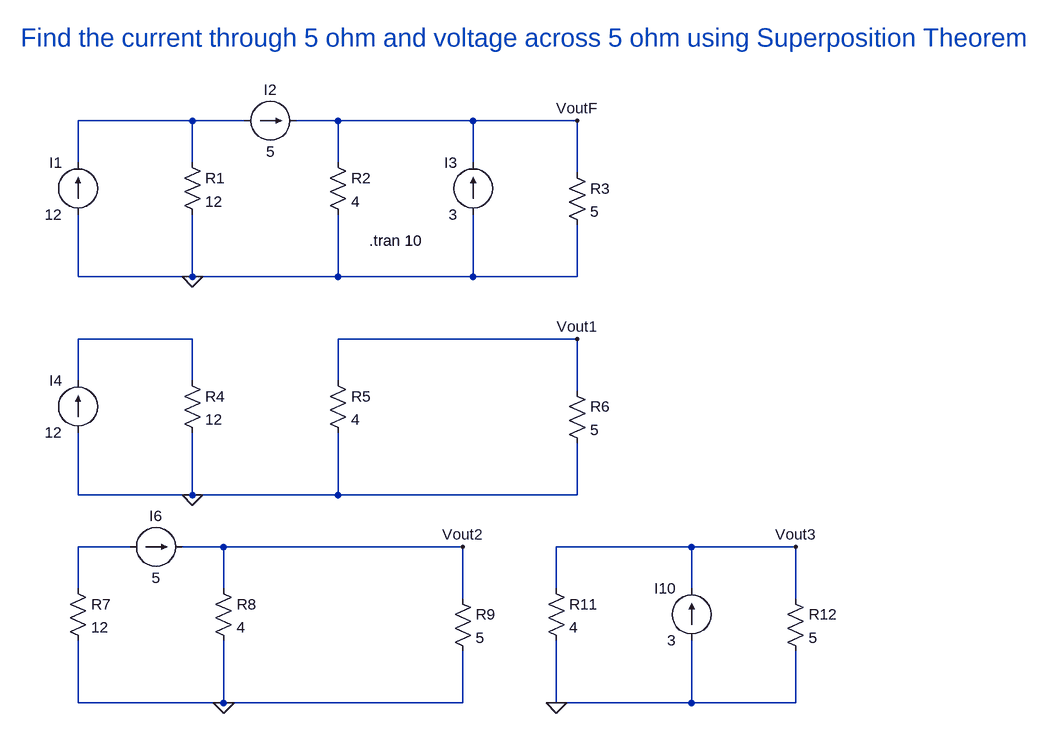
[diagram p0: schematic Lab1_ques2.asc]
Lab1_ques2.asc, the LTspice schematic file:
Version 4
SHEET 1 1444 1152
WIRE -496 160 -672 160
WIRE -416 160 -496 160
WIRE -272 160 -336 160
WIRE -64 160 -272 160
WIRE 96 160 -64 160
WIRE -672 224 -672 160
WIRE -496 224 -496 160
WIRE -272 224 -272 160
WIRE -64 224 -64 160
WIRE 96 240 96 160
WIRE -672 400 -672 304
WIRE -496 400 -496 304
WIRE -496 400 -672 400
WIRE -272 400 -272 304
WIRE -272 400 -496 400
WIRE -64 400 -64 304
WIRE -64 400 -272 400
WIRE 96 400 96 320
WIRE 96 400 -64 400
WIRE -496 496 -672 496
WIRE 96 496 -272 496
WIRE -672 560 -672 496
WIRE -496 560 -496 496
WIRE -272 560 -272 496
WIRE 96 576 96 496
WIRE -672 736 -672 640
WIRE -496 736 -496 640
WIRE -496 736 -672 736
WIRE -272 736 -272 640
WIRE -272 736 -496 736
WIRE 96 736 96 656
WIRE 96 736 -272 736
WIRE -592 816 -672 816
WIRE -448 816 -512 816
WIRE -80 816 -448 816
WIRE 272 816 64 816
WIRE 432 816 272 816
WIRE -672 880 -672 816
WIRE -448 880 -448 816
WIRE 64 880 64 816
WIRE 272 880 272 816
WIRE -80 896 -80 816
WIRE 432 896 432 816
WIRE -672 1056 -672 960
WIRE -448 1056 -448 960
WIRE -448 1056 -672 1056
WIRE -80 1056 -80 976
WIRE -80 1056 -448 1056
WIRE 64 1056 64 960
WIRE 272 1056 272 960
WIRE 272 1056 64 1056
WIRE 432 1056 432 976
WIRE 432 1056 272 1056
FLAG 96 160 VoutF
FLAG 96 496 Vout1
FLAG -80 816 Vout2
FLAG 432 816 Vout3
FLAG -496 736 0
FLAG -496 400 0
FLAG -448 1056 0
FLAG 64 1056 0
SYMBOL res -512 208 R0
SYMATTR InstName R1
SYMATTR Value 12
SYMBOL res -288 208 R0
SYMATTR InstName R2
SYMATTR Value 4
SYMBOL current -672 304 R180
WINDOW 0 24 80 Left 2
WINDOW 3 24 0 Left 2
WINDOW 123 0 0 Left 0
WINDOW 39 0 0 Left 0
SYMATTR InstName I1
SYMATTR Value 12
SYMBOL current -416 160 R270
WINDOW 0 32 40 VTop 2
WINDOW 3 -32 40 VBottom 2
WINDOW 123 0 0 Left 0
WINDOW 39 0 0 Left 0
SYMATTR InstName I2
SYMATTR Value 5
SYMBOL current -64 304 R180
WINDOW 0 24 80 Left 2
WINDOW 3 24 0 Left 2
WINDOW 123 0 0 Left 0
WINDOW 39 0 0 Left 0
SYMATTR InstName I3
SYMATTR Value 3
SYMBOL res 80 224 R0
SYMATTR InstName R3
SYMATTR Value 5
SYMBOL res -512 544 R0
SYMATTR InstName R4
SYMATTR Value 12
SYMBOL res -288 544 R0
SYMATTR InstName R5
SYMATTR Value 4
SYMBOL current -672 640 R180
WINDOW 0 24 80 Left 2
WINDOW 3 24 0 Left 2
WINDOW 123 0 0 Left 0
WINDOW 39 0 0 Left 0
SYMATTR InstName I4
SYMATTR Value 12
SYMBOL res 80 560 R0
SYMATTR InstName R6
SYMATTR Value 5
SYMBOL res -688 864 R0
SYMATTR InstName R7
SYMATTR Value 12
SYMBOL res -464 864 R0
SYMATTR InstName R8
SYMATTR Value 4
SYMBOL current -592 816 R270
WINDOW 0 32 40 VTop 2
WINDOW 3 -32 40 VBottom 2
WINDOW 123 0 0 Left 0
WINDOW 39 0 0 Left 0
SYMATTR InstName I6
SYMATTR Value 5
SYMBOL res -96 880 R0
SYMATTR InstName R9
SYMATTR Value 5
SYMBOL res 48 864 R0
SYMATTR InstName R11
SYMATTR Value 4
SYMBOL current 272 960 R180
WINDOW 0 24 80 Left 2
WINDOW 3 24 0 Left 2
WINDOW 123 0 0 Left 0
WINDOW 39 0 0 Left 0
SYMATTR InstName I10
SYMATTR Value 3
SYMBOL res 416 880 R0
SYMATTR InstName R12
SYMATTR Value 5
TEXT -760 32 Left 4 ;Find the current through 5 ohm and voltage across 5 ohm using Superposition Theorem
TEXT -224 344 Left 2 !.tran 10

The netlist it stands for:
* Lab1_ques2.asc
R1 N001 0 12
R2 VoutF 0 4
I1 0 N001 12
I2 N001 VoutF 5
I3 0 VoutF 3
R3 VoutF 0 5
R4 N002 0 12
R5 Vout1 0 4
I4 0 N002 12
R6 Vout1 0 5
R7 N003 0 12
R8 Vout2 0 4
I6 N003 Vout2 5
R9 Vout2 0 5
R11 Vout3 0 4
I10 0 Vout3 3
R12 Vout3 0 5
* Find the current through 5 ohm and voltage across 5 ohm using Superposition Theorem
.tran 10
.backanno
.end